# Altium schematic sheet mic.SchDoc
size A3
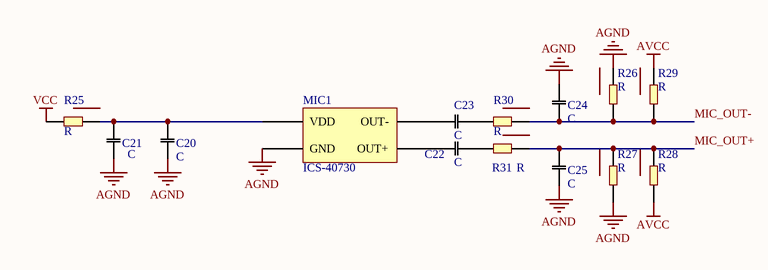
[diagram p0: mic.SchDoc]

## Parts
C20  C  [402]
C21  C  [402]
C22  C  [402]
C23  C  [402]
C24  C  [402]
C25  C  [402]
MIC1  ICS-40730  [ICS-40730]
R25  R  [603]
R26  R  [402]
R27  R  [402]
R28  R  [402]
R29  R  [402]
R30  R  [402]
R31  R  [402]

## Nets
AGND: C20.1 C21.1 C24.2 C25.1 MIC1.4(GND) R26.2 R27.1
AVCC: R28.1 R29.2
VCC: R25.1
MIC_OUT+: C25.2 R27.2 R28.2 R31.2
MIC_OUT-: C24.1 R26.1 R29.1 R30.2
NetC20_2: C20.2 C21.2 MIC1.1(VDD) R25.2
NetC22_1: C22.1 R31.1
NetC22_2: C22.2 MIC1.3(OUT+)
NetC23_1: C23.1 R30.1
NetC23_2: C23.2 MIC1.2(OUT-)

## Library data of the parts
C20-C25 = C: Capacitor
R25-R31 = R: Resistor